# Altium schematic sheet LEDs.SchDoc
size A4; SheetNumber: 12; SheetTotal: 16
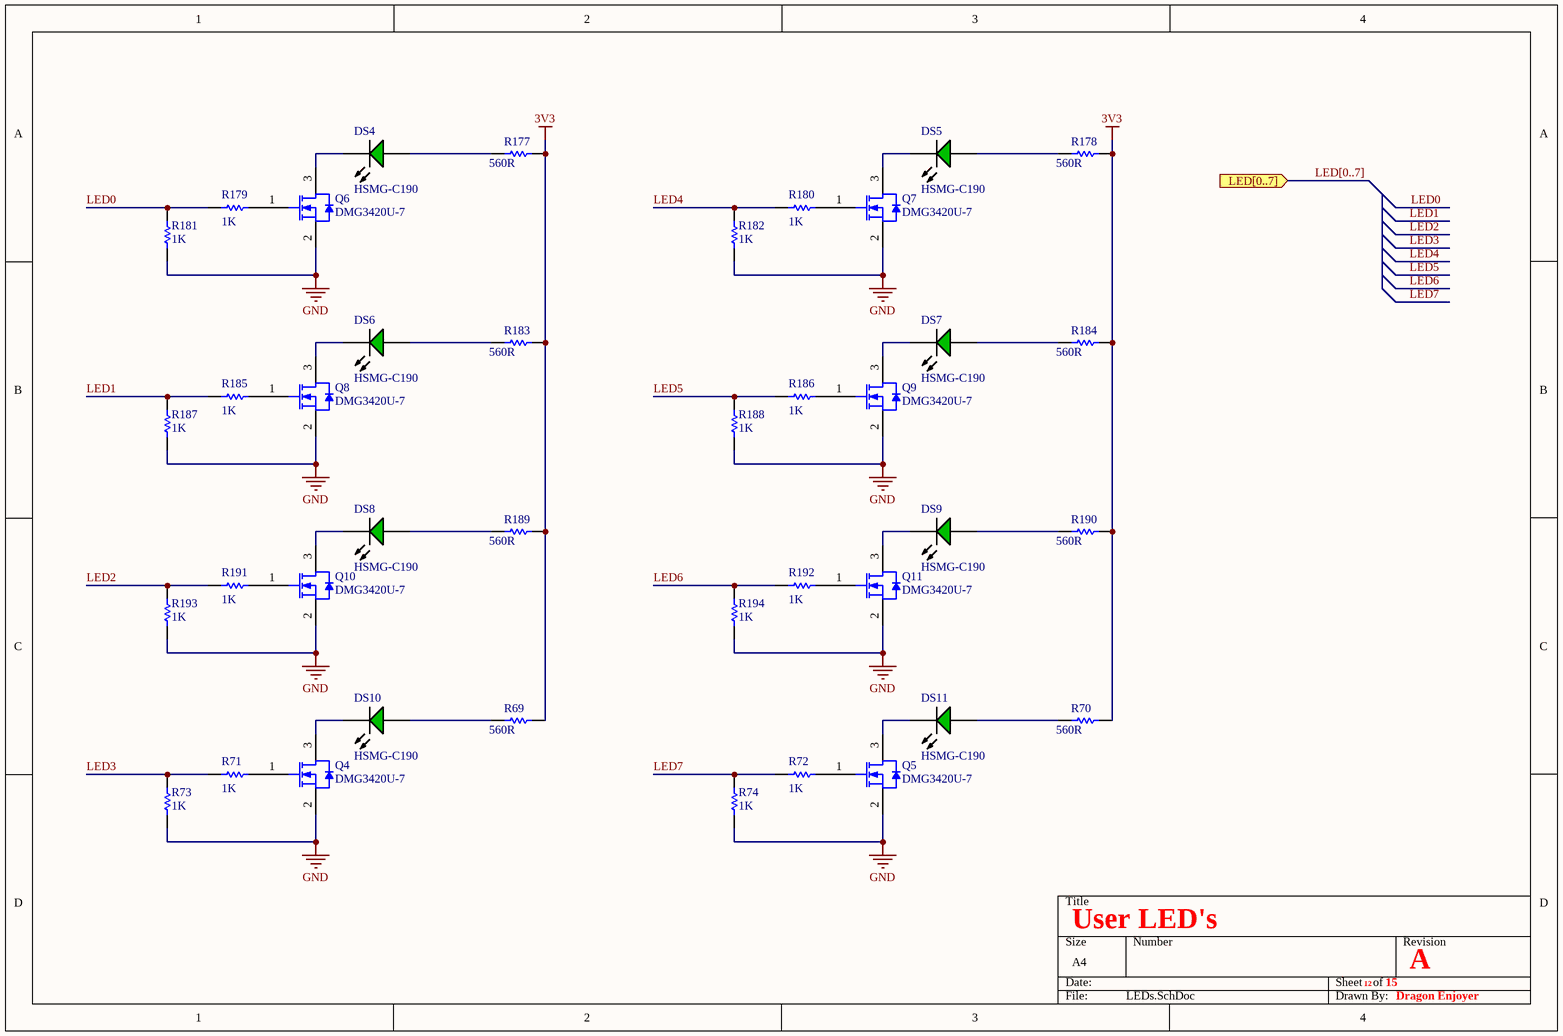
[diagram p0: LEDs.SchDoc]

## Parts
DS4  HSMG-C190  [AVAG-HSMX-C190_V]
DS5  HSMG-C190  [AVAG-HSMX-C190_V]
DS6  HSMG-C190  [AVAG-HSMX-C190_V]
DS7  HSMG-C190  [AVAG-HSMX-C190_V]
DS8  HSMG-C190  [AVAG-HSMX-C190_V]
DS9  HSMG-C190  [AVAG-HSMX-C190_V]
DS10  HSMG-C190  [AVAG-HSMX-C190_V]
DS11  HSMG-C190  [AVAG-HSMX-C190_V]
Q4  DMG3420U-7  [DIOD-SOT23-3_B_V]
Q5  DMG3420U-7  [DIOD-SOT23-3_B_V]
Q6  DMG3420U-7  [DIOD-SOT23-3_B_V]
Q7  DMG3420U-7  [DIOD-SOT23-3_B_V]
Q8  DMG3420U-7  [DIOD-SOT23-3_B_V]
Q9  DMG3420U-7  [DIOD-SOT23-3_B_V]
Q10  DMG3420U-7  [DIOD-SOT23-3_B_V]
Q11  DMG3420U-7  [DIOD-SOT23-3_B_V]
R69  value 560R  [RESC1608X55X30LL20T20]  (hidden comment: ERA3AEB561V)
R70  value 560R  [RESC1608X55X30LL20T20]  (hidden comment: ERA3AEB561V)
R71  value 1K  [RESC1005X40X25NL05T10]  (hidden comment: RC0402FR-071KL)
R72  value 1K  [RESC1005X40X25NL05T10]  (hidden comment: RC0402FR-071KL)
R73  value 1K  [RESC1005X40X25NL05T10]  (hidden comment: RC0402FR-071KL)
R74  value 1K  [RESC1005X40X25NL05T10]  (hidden comment: RC0402FR-071KL)
R177  value 560R  [RESC1608X55X30LL20T20]  (hidden comment: ERA3AEB561V)
R178  value 560R  [RESC1608X55X30LL20T20]  (hidden comment: ERA3AEB561V)
R179  value 1K  [RESC1005X40X25NL05T10]  (hidden comment: RC0402FR-071KL)
R180  value 1K  [RESC1005X40X25NL05T10]  (hidden comment: RC0402FR-071KL)
R181  value 1K  [RESC1005X40X25NL05T10]  (hidden comment: RC0402FR-071KL)
R182  value 1K  [RESC1005X40X25NL05T10]  (hidden comment: RC0402FR-071KL)
R183  value 560R  [RESC1608X55X30LL20T20]  (hidden comment: ERA3AEB561V)
R184  value 560R  [RESC1608X55X30LL20T20]  (hidden comment: ERA3AEB561V)
R185  value 1K  [RESC1005X40X25NL05T10]  (hidden comment: RC0402FR-071KL)
R186  value 1K  [RESC1005X40X25NL05T10]  (hidden comment: RC0402FR-071KL)
R187  value 1K  [RESC1005X40X25NL05T10]  (hidden comment: RC0402FR-071KL)
R188  value 1K  [RESC1005X40X25NL05T10]  (hidden comment: RC0402FR-071KL)
R189  value 560R  [RESC1608X55X30LL20T20]  (hidden comment: ERA3AEB561V)
R190  value 560R  [RESC1608X55X30LL20T20]  (hidden comment: ERA3AEB561V)
R191  value 1K  [RESC1005X40X25NL05T10]  (hidden comment: RC0402FR-071KL)
R192  value 1K  [RESC1005X40X25NL05T10]  (hidden comment: RC0402FR-071KL)
R193  value 1K  [RESC1005X40X25NL05T10]  (hidden comment: RC0402FR-071KL)
R194  value 1K  [RESC1005X40X25NL05T10]  (hidden comment: RC0402FR-071KL)

## Ports
LED[0..7] (in)

## Nets
3V3: R69.2 R70.2 R177.2 R178.2 R183.2 R184.2 R189.2 R190.2
GND: Q4.2(S) Q5.2(S) Q6.2(S) Q7.2(S) Q8.2(S) Q9.2(S) Q10.2(S) Q11.2(S) R73.1 R74.1 R181.1 R182.1 R187.1 R188.1 R193.1 R194.1
LED0: R179.1 R181.2
LED1: R185.1 R187.2
LED2: R191.1 R193.2
LED3: R71.1 R73.2
LED4: R180.1 R182.2
LED5: R186.1 R188.2
LED6: R192.1 R194.2
LED7: R72.1 R74.2
NetDS4_1: DS4.1(A) R177.1
NetDS4_2: DS4.2(K) Q6.3(D)
NetDS5_1: DS5.1(A) R178.1
NetDS5_2: DS5.2(K) Q7.3(D)
NetDS6_1: DS6.1(A) R183.1
NetDS6_2: DS6.2(K) Q8.3(D)
NetDS7_1: DS7.1(A) R184.1
NetDS7_2: DS7.2(K) Q9.3(D)
NetDS8_1: DS8.1(A) R189.1
NetDS8_2: DS8.2(K) Q10.3(D)
NetDS9_1: DS9.1(A) R190.1
NetDS9_2: DS9.2(K) Q11.3(D)
NetDS10_1: DS10.1(A) R69.1
NetDS10_2: DS10.2(K) Q4.3(D)
NetDS11_1: DS11.1(A) R70.1
NetDS11_2: DS11.2(K) Q5.3(D)
NetQ4_1: Q4.1(G) R71.2
NetQ5_1: Q5.1(G) R72.2
NetQ6_1: Q6.1(G) R179.2
NetQ7_1: Q7.1(G) R180.2
NetQ8_1: Q8.1(G) R185.2
NetQ9_1: Q9.1(G) R186.2
NetQ10_1: Q10.1(G) R191.2
NetQ11_1: Q11.1(G) R192.2

## Buses and harness runs
bus LED[0..7] = port LED[0..7]

## Notes on the sheet
- User LED's
- 12
- 15
- A
- Dragon Enjoyer

## Library data of the parts
DS4-DS11 = CMP-1744-00002-1: Chip LED, Green, 2.2 V, -40 to 85 degC, 2-Pin SMD, RoHS, Tape and Reel; Frequency: 400 KHz; Max Supply Voltage: 5.5 V; Access Time: 3500 ns; Clock Frequency: 100 KHz; Case\Package: SOIC; Density: 32 kb; Nominal Supply Current: 2 mA; Interface: Serial; Min Supply Voltage: 1.7 V; Packaging: Tape and Reel; PackageReference: HSMX-C190; ComponentLink2URL: http://docs.avagotech.com/docs/AV02-0551EN; RoHSCompliant: true; Pins: 8; REACH SVHC: No SVHC; Max Operating Temperature: 85 degC; Width: 4 mm; Radiation Hardening: No; Package Quantity: 3000; ComponentLink3Description: Package Specification; ComponentLink1Description: Manufacturer URL; Min Operating Temperature: -40 degC; PackageDescription: 2-Pin Surface Mount Device, Body 1.6 x 0.8 mm, Height 0.9 mm; Max Clock Frequency: 100 KHz; Height: 1.5 mm; ComponentLink1URL: http://www.avagotech.com/; DatasheetVersion: Mar-12; ComponentLink2Description: Datasheet; Mount: Surface Mount; Length: 5 mm; ComponentLink3URL: http://www.fairchildsemi.com/dwg/MA/MA03D.pdf
Q4-Q11 = CMP-2000-06172-1: N-Channel Enhancement Mode MOSFET, 20 V, -55 to 150 degC, 3-Pin SOT23, RoHS, Tape and Reel; Manufacturer: Diodes Inc; Drain-Source On Resistance-Max: 29mO; Qg Gate Charge: 5.4nC; Drain-to-Source Voltage [Vdss]: 20V; Rated Power Dissipation: 740mW; Datasheet URL: http://www.diodes.com/_files/datasheets/ds31867.pdf; Package Description: 3-Pin Small Outline Transistor, Body 2.9 x 1.3 mm, Pitch 0.96 mm; Package Reference: SOT23-3; Datasheet Version: Rev. 5-2, 09/2013; Mounting Technology: SurfaceMount; Channel Type: N-Channel; Manufacturer URL: http://www.diodes.com/
R69 R70 R177 R178 R183 R184 R189 R190 = CMP-2000-00091-1: Manufacturer: Panasonic; Part Number: ERA3AEB561V
R71-R74 R179-R182 R185-R188 R191-R194 = CMP-2002-07472-1: Manufacturer: Yageo / Phycomp; Part Number: RC0402FR-071KL